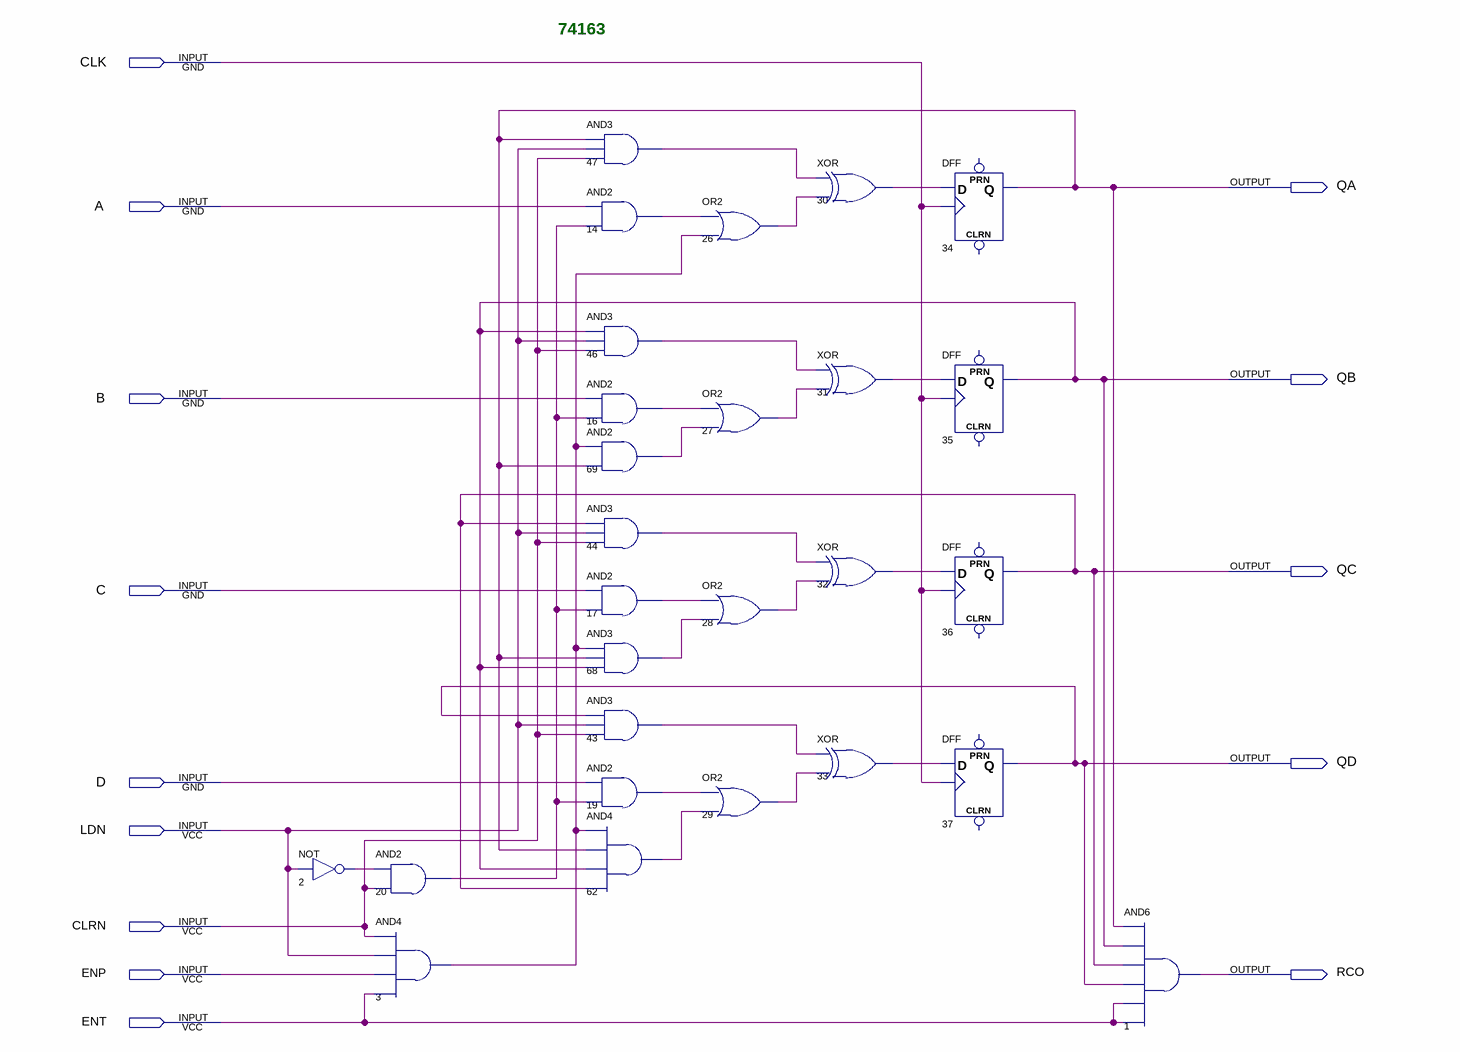
[diagram p0: schematic sheet]
// Quartus schematic p74163.bdf as structural Verilog: 27 symbols, 14 pins
module p74163 (
  input  CLK,
  input  A,
  input  B,
  input  C,
  input  D,
  input  LDN,
  input  CLRN,
  input  ENP,
  input  ENT,
  output QA,
  output QB,
  output QC,
  output QD,
  output RCO
);

  wire n2_out, n3_out, n14_out, n16_out, n17_out, n19_out, n20_out, n26_out, n27_out, n28_out, n29_out,
       n30_out, n31_out, n32_out, n33_out, n43_out, n44_out, n46_out, n47_out, n62_out, n68_out, n69_out;

  not u_2 (n2_out, LDN);
  and u_20 (n20_out, n2_out, CLRN);
  and u_3 (n3_out, CLRN, LDN, ENP, ENT);
  and u_47 (n47_out, QA, LDN, CLRN);
  and u_14 (n14_out, A, n20_out);
  and u_46 (n46_out, QB, LDN, CLRN);
  and u_16 (n16_out, B, n20_out);
  and u_69 (n69_out, n3_out, QA);
  and u_44 (n44_out, QC, LDN, CLRN);
  and u_17 (n17_out, C, n20_out);
  and u_68 (n68_out, n3_out, QA, QB);
  and u_43 (n43_out, QD, LDN, CLRN);
  and u_19 (n19_out, D, n20_out);
  and u_62 (n62_out, n3_out, QA, QB, QC);
  or u_26 (n26_out, n14_out, n3_out);
  or u_27 (n27_out, n16_out, n69_out);
  or u_28 (n28_out, n17_out, n68_out);
  or u_29 (n29_out, n19_out, n62_out);
  xor u_30 (n30_out, n47_out, n26_out);
  xor u_31 (n31_out, n46_out, n27_out);
  xor u_32 (n32_out, n44_out, n28_out);
  xor u_33 (n33_out, n43_out, n29_out);
  DFF u_34 (.CLK(CLK), .D(n30_out), .Q(QA));  // open: CLRN, PRN
  DFF u_35 (.CLK(CLK), .D(n31_out), .Q(QB));  // open: CLRN, PRN
  DFF u_36 (.CLK(CLK), .D(n32_out), .Q(QC));  // open: CLRN, PRN
  DFF u_37 (.CLK(CLK), .D(n33_out), .Q(QD));  // open: CLRN, PRN
  and u_1 (RCO, QA, QB, QC, QD, ENT, ENT);

  // Notes on the sheet:
  //   74163
endmodule
